# EAGLE schematic wordclock_final (EAGLE 9.6.2)
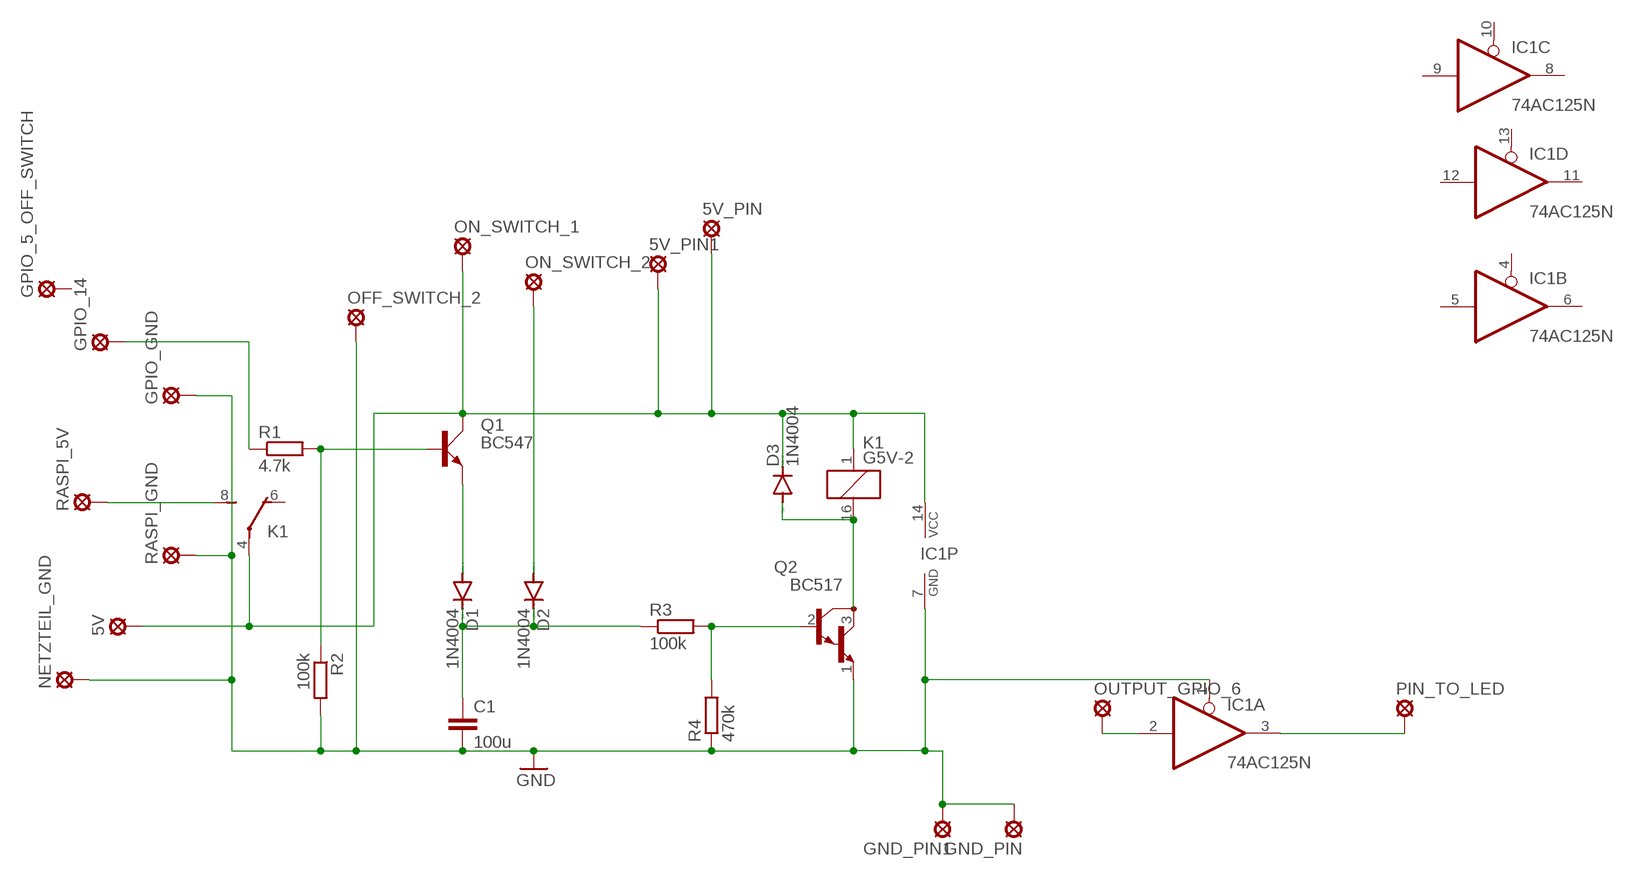
[diagram p0: schematic, sheet 1]

## Parts
5V  SE14  [SE14]
5V_PIN  SE14  [SE14]
5V_PIN1  SE14  [SE14]
C1  100u  C-EU025-060X050  [C025-060X050]
D1  1N4004  [DO41-10]
D2  1N4004  [DO41-10]
D3  1N4004  [DO41-10]
GND_PIN  SE14  [SE14]
GND_PIN1  SE14  [SE14]
GPIO_5_OFF_SWITCH  SE14  [SE14]
GPIO_14  SE14  [SE14]
GPIO_GND  SE14  [SE14]
IC1  74AC125N  [DIL14]
K1  G5V-2  [G5V-2]
NETZTEIL_GND  SE14  [SE14]
OFF_SWITCH_2  SE14  [SE14]
ON_SWITCH_1  SE14  [SE14]
ON_SWITCH_2  SE14  [SE14]
OUTPUT_GPIO_6  SE14  [SE14]
PIN_TO_LED  SE14  [SE14]
Q1  BC547  [SOT54A]
Q2  BC517  [TO92]
R1  4.7k  R-EU_0207/10  [0207/10]
R2  100k  R-EU_0207/10  [0207/10]
R3  100k  R-EU_0207/10  [0207/10]
R4  470k  R-EU_0207/10  [0207/10]
RASPI_5V  SE14  [SE14]
RASPI_GND  SE14  [SE14]

## Nets
GND: C1.2 GND_PIN1.MP GND_PIN.MP GPIO_GND.MP IC1.1(A:OE) IC1.7(P:GND) NETZTEIL_GND.MP OFF_SWITCH_2.MP Q2.1(E) R2.2 R4.1 RASPI_GND.MP
N$1: Q1.B R1.2 R2.1
N$2: D1.A Q1.E
N$3: D2.A ON_SWITCH_2.MP
N$4: IC1.2(A:I) OUTPUT_GPIO_6.MP
N$5: Q2.2(B) R3.2 R4.2
N$6: D3.A K1.16 Q2.3(C)
N$7: 5V.MP 5V_PIN1.MP 5V_PIN.MP D3.C IC1.14(P:VCC) K1.1 K1.4(1:P) ON_SWITCH_1.MP Q1.C
N$8: C1.1 D1.C D2.C R3.1
N$10: GPIO_14.MP R1.1
N$11: K1.8(1:S) RASPI_5V.MP
N$12: IC1.3(A:O) PIN_TO_LED.MP
Unconnected: GPIO_5_OFF_SWITCH.MP IC1.4(B:OE) IC1.5(B:I) IC1.6(B:O) IC1.8(C:O) IC1.9(C:I) IC1.10(C:OE) IC1.11(D:O) IC1.12(D:I) IC1.13(D:OE) K1.6(1:O) K1.9(2:S) K1.11(2:O) K1.13(2:P)

## Library data of the parts
5V 5V_PIN 5V_PIN1 GND_PIN GND_PIN1 GPIO_5_OFF_SWITCH GPIO_14 GPIO_GND NETZTEIL_GND OFF_SWITCH_2 ON_SWITCH_1 ON_SWITCH_2 OUTPUT_GPIO_6 PIN_TO_LED RASPI_5V RASPI_GND = solpad:SE14: SOLDER PAD E1553, drill 1,4mm, distributor Buerklin, 07F820
C1 = rcl:C-EU: CAPACITOR, European symbol; SPICEPREFIX: C
D1-D3 = diode:1N4004: DIODE general purpose rectifier, 1 A
IC1 = 74xx-eu:74*125: Quad bus BUFFER, 3-state
K1 = relay:G5V-2: OMRON PCB Relay Source: http://www.omron.com/ecb/products/pdf/en-g5v2.pdf; MPN: G5V-2 5DC; OC_FARNELL: 9949488; OC_NEWARK: 78K5703
Q1 = transistor-small-signal:BC547: NPN TRANSISTOR
Q2 = transistor-npn:BC517*: NPN Darlington Transistor
R1-R4 = rcl:R-EU_: RESISTOR, European symbol; SPICEPREFIX: R